# Altium schematic sheet MODULIQ_ADC_40M_20B_2CH.SchDoc: 2ch ADC 40MSPS 20b
size A3; Author: M.Beldyga; CompanyName: WUT ISE; DrawnBy: M.Beldyga; Organization: WUT ISE; Address1: PW ISE; Address2: Nowowiejska 15/19 00-665 Warsaw; Address3: micbeldyga@gmail.com; SheetNumber: 1; SheetTotal: 4; ModifiedBy: -; CheckedDate: -; Title2: MODULIQ; DivGrp: WUT ISE; Designer: M.Beldyga; ModifiedDate: -; ProjectName: Sensor Box
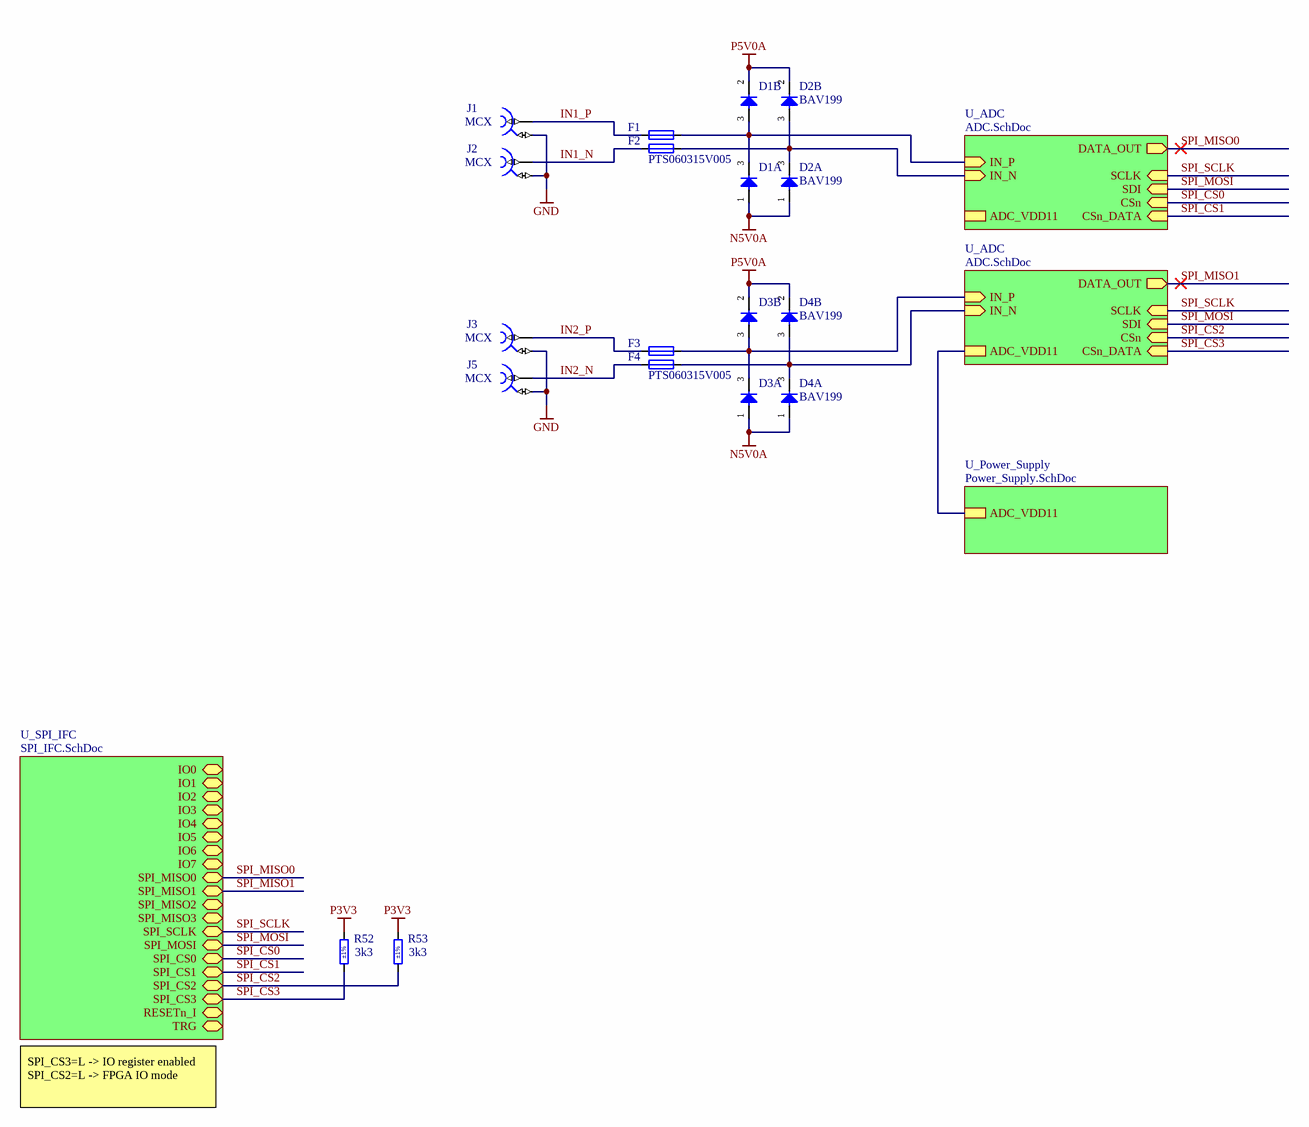
[diagram p0: MODULIQ_ADC_40M_20B_2CH.SchDoc]

## Parts
D1  BAV199  [SOT95P240X110-3N]  (value not drawn)  (parts A,B of 2)
D2  BAV199  [SOT95P240X110-3N]  (parts A,B of 2)
D3  BAV199  [SOT95P240X110-3N]  (value not drawn)  (parts A,B of 2)
D4  BAV199  [SOT95P240X110-3N]  (parts A,B of 2)
F1  PTS060315V005  [CAPC1709X08N]  (value not drawn)
F2  PTS060315V005  [CAPC1709X08N]
F3  PTS060315V005  [CAPC1709X08N]  (value not drawn)
F4  PTS060315V005  [CAPC1709X08N]
J1  MCX  [AMPHENOL_919-109J-51PX]
J2  MCX  [AMPHENOL_919-109J-51PX]
J3  MCX  [AMPHENOL_919-109J-51PX]
J5  MCX  [AMPHENOL_919-109J-51PX]
R52  3k3  Tolerance: ±1%  [RESC1005X40N]
R53  3k3  Tolerance: ±1%  [RESC1005X40N]

## Sub-sheets
U_ADC = ADC.SchDoc: DATA_OUT (out), SCLK (in), SDI (in), CSn (in), CSn_DATA (in), IN_P (in), IN_N (in), ADC_VDD11
U_ADC = ADC.SchDoc: DATA_OUT (out), SCLK (in), SDI (in), CSn (in), CSn_DATA (in), IN_P (in), IN_N (in), ADC_VDD11
U_Power_Supply = Power_Supply.SchDoc: ADC_VDD11
U_SPI_IFC = SPI_IFC.SchDoc: IO0 (bidir), IO1 (bidir), IO2 (bidir), IO3 (bidir), IO4 (bidir), IO5 (bidir), IO6 (bidir), IO7 (bidir), SPI_MISO0 (bidir), SPI_MISO1 (bidir), SPI_MISO2 (bidir), SPI_MISO3 (bidir), SPI_SCLK (bidir), SPI_MOSI (bidir), SPI_CS0 (bidir), SPI_CS1 (bidir), SPI_CS2 (bidir), SPI_CS3 (bidir), RESETn_I (bidir), TRG (bidir)

## Nets
GND: J1.2 J2.2 J3.2 J5.2
N5V0A: D1.1(A) D2.1(A) D3.1(A) D4.1(A)
P3V3: R52.1 R53.1
P5V0A: D1.2(C) D2.2(C) D3.2(C) D4.2(C)
IN1_N: F2.1 J2.1
IN1_P: F1.1 J1.1
IN2_N: F4.1 J5.1
IN2_P: F3.1 J3.1
SPI_CS0: sheet U_SPI_IFC/SPI_CS0, sheet U_ADC/CSn
SPI_CS1: sheet U_SPI_IFC/SPI_CS1, sheet U_ADC/CSn_DATA
SPI_CS2: R53.2 ; sheet U_SPI_IFC/SPI_CS2, sheet U_ADC/CSn
SPI_CS3: R52.2 ; sheet U_SPI_IFC/SPI_CS3, sheet U_ADC/CSn_DATA
SPI_MISO0: sheet U_SPI_IFC/SPI_MISO0, sheet U_ADC/DATA_OUT
SPI_MISO1: sheet U_SPI_IFC/SPI_MISO1, sheet U_ADC/DATA_OUT
SPI_MOSI: sheet U_SPI_IFC/SPI_MOSI, sheet U_ADC/SDI, sheet U_ADC/SDI
SPI_SCLK: sheet U_SPI_IFC/SPI_SCLK, sheet U_ADC/SCLK, sheet U_ADC/SCLK
NetD1_3: D1.3(COMAC) F1.2 ; sheet U_ADC/IN_P
NetD2_3: D2.3(COMAC) F2.2 ; sheet U_ADC/IN_N
NetD3_3: D3.3(COMAC) F3.2 ; sheet U_ADC/IN_P
NetD4_3: D4.3(COMAC) F4.2 ; sheet U_ADC/IN_N
(unnamed): sheet U_ADC/ADC_VDD11, sheet U_Power_Supply/ADC_VDD11

## Notes on the sheet
- SPI_CS3=L -> IO register enabled
  SPI_CS2=L -> FPGA IO mode
- Project/Equipment
- Document
- Designer
- Drawn by
- Check.by
- Contact
- File
- Last Mod.
- Print Date
- Sheet
- Size
- A3
- of
- Rev

## Library data of the parts
D1-D4 = BAV199: Serial Diode; Part Description: Low-Leakage Double Diode; Manufacturer: NXP SEMICONDUCTORS; Voltage: 75V; Power: 250mW; PressFit: No; Bonding: No; Part Number: BAV199; Component Kind: Standard; Component Type: Standard; Device: BAV199; PackageDescription: SOT, 0.95mm Pitch; 3 Pin, 1.40mm W X 3.00mm L X 1.10mm H body, IPC Medium Density; Manufacturer Part Number: BAV199; Pin Count: 3; Case: SOT23-3; Mounted: Yes; Socket: No; SMD: Yes; Sense: No; ComponentHeight: 1.1mm; HelpURL: \\cern.ch\dfs\Applications\Altium\Datasheets\BAV199.pdf; Author: CERN DEM JMW; CreateDate: 11/21/2008; LatestRevisionDate: 11/21/2008
F1-F4 = PTS060315V005: Ptc Reset Fuse 50MA 15V 0603; Manufacturer: Eaton Bussmann; Supplier: Mouser; Supplier Part Number: 504-PTS060315V005; Manufacturer Part Number: PTS060315V005; RoHS: No; Category: PTC Resettable Fuses; Stock: 5464; Pricing: 1=0.19, 10=0.16, 50=0.16, 100=0.132, 1000=0.105, 10000=0.065 (USD); ComponentLink1URL: https://datasheet.octopart.com/PTS060315V005-Cooper-Bussmann-datasheet-158256509.pdf?src-supplier=Sager+Electronics; ComponentLink1Description: https://datasheet.octopart.com/PTS060315V005-Cooper-Bussmann-datasheet-158256509.pdf?src-supplier=Sager+Electronics
J1-J3 J5 = AMPHENOL_919-109J-51PX: Part Description: 50 Ohms, RF Connector, MCX Straight PCB Receptacle Jack; Manufacturer Part Number: 919-109J-51PX (MCX6251B1-3GT30G-50); PressFit: No; Part Number: AMPHENOL_919-109J-51PX; Component Kind: Standard; Component Type: Standard; Pin Count: 5; Family: MCX; Mounted: Yes; Socket: No; SMD: No; Sense: No; Status: None; Manufacturer: AMPHENOL; ComponentHeight: 6.06mm; HelpURL: \\cern.ch\dfs\Applications\Altium\Datasheets\AMPHENOL_919-109J-51PX.pdf; Author: CERN DEM BC; CreateDate: 31.01.2019; LatestRevisionDate: 31.01.2019
R52 R53 = R0402_3K3_1%_0.0625W_100PPM: Resistor - 1%; Part Description: General Purpose Thick Film Chip Resistor; Manufacturer: GENERIC; Manufacturer1 Part Number: 232270673302L; TC: ±100ppm/°C; PressFit: No; Part Number: R0402_3K3_1%_0.0625W_100PPM; Component Kind: Standard; Component Type: Standard; Pin Count: 2; Value: 3k3; Status: Not Recommended; Power: 0.0625W; Manufacturer Part Number: R0402_3K3_1%_0.0625W_100PPM; Case: 0402; Mounted: Yes; Sense: No; Socket: No; SMD: Yes; Manufacturer1 Example: YAGEO PHYCOMP; Manufacturer1 ComponentHeight: 0.4mm; HelpURL: \\cern.ch\dfs\Applications\Altium\Datasheets\R0402_Phycomp_RC0402.pdf; Author: CERN DEM JLC; CreateDate: 03.12.2007; LatestRevisionDate: 17.10.2012